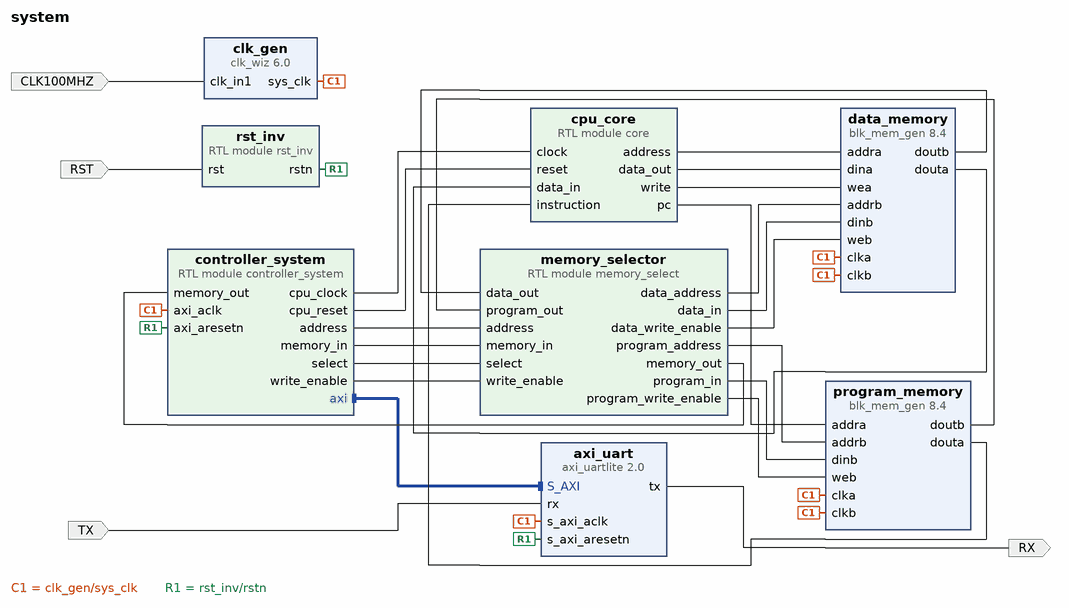
[diagram p0: block diagram of the top level]
# Vivado block design system, xc7a100tcsg324-1, Vivado 2023.1.1
create_bd_design system

create_bd_port -dir I -type data TX
create_bd_port -dir O -type data RX
create_bd_port -dir I -type clk CLK100MHZ
set_property -dict {CONFIG.FREQ_HZ 100000000} [get_bd_ports CLK100MHZ]
create_bd_port -dir I -type rst RST
set_property -dict {CONFIG.POLARITY ACTIVE_HIGH} [get_bd_ports RST]

create_bd_cell -type ip -vlnv xilinx.com:ip:axi_uartlite:2.0 axi_uart
set_property -dict {CONFIG.C_BAUDRATE 115200 CONFIG.UARTLITE_BOARD_INTERFACE Custom} [get_bd_cells axi_uart]
create_bd_cell -type module -reference rst_inv rst_inv
create_bd_cell -type ip -vlnv xilinx.com:ip:blk_mem_gen:8.4 data_memory
set_property -dict [list \
  CONFIG.Additional_Inputs_for_Power_Estimation false \
  CONFIG.Algorithm Minimum_Area \
  CONFIG.Assume_Synchronous_Clk true \
  CONFIG.Enable_A Always_Enabled \
  CONFIG.Enable_B Always_Enabled \
  CONFIG.Fill_Remaining_Memory_Locations true \
  CONFIG.Load_Init_File false \
  CONFIG.Memory_Type True_Dual_Port_RAM \
  CONFIG.Operating_Mode_A NO_CHANGE \
  CONFIG.Operating_Mode_B NO_CHANGE \
  CONFIG.Read_Width_B 32 \
  CONFIG.Register_PortA_Output_of_Memory_Core false \
  CONFIG.Register_PortA_Output_of_Memory_Primitives false \
  CONFIG.Register_PortB_Output_of_Memory_Primitives false \
  CONFIG.Remaining_Memory_Locations DEADBEEF \
  CONFIG.Use_RSTA_Pin false \
  CONFIG.Write_Depth_A 1024 \
  CONFIG.Write_Width_B 8 \
  CONFIG.use_bram_block Stand_Alone \
] [get_bd_cells data_memory]
create_bd_cell -type ip -vlnv xilinx.com:ip:blk_mem_gen:8.4 program_memory
set_property -dict [list \
  CONFIG.Assume_Synchronous_Clk true \
  CONFIG.Enable_A Always_Enabled \
  CONFIG.Enable_B Always_Enabled \
  CONFIG.Fill_Remaining_Memory_Locations true \
  CONFIG.Memory_Type True_Dual_Port_RAM \
  CONFIG.Operating_Mode_A READ_FIRST \
  CONFIG.Operating_Mode_B WRITE_FIRST \
  CONFIG.Read_Width_B 16 \
  CONFIG.Register_PortA_Output_of_Memory_Primitives false \
  CONFIG.Register_PortB_Output_of_Memory_Primitives false \
  CONFIG.Remaining_Memory_Locations FFFF \
  CONFIG.Write_Depth_A 1024 \
  CONFIG.Write_Width_A 16 \
  CONFIG.Write_Width_B 8 \
  CONFIG.use_bram_block Stand_Alone \
] [get_bd_cells program_memory]
create_bd_cell -type ip -vlnv xilinx.com:ip:clk_wiz:6.0 clk_gen
set_property -dict [list \
  CONFIG.CLKOUT1_DRIVES BUFGCE \
  CONFIG.CLKOUT1_JITTER 116.394 \
  CONFIG.CLKOUT1_PHASE_ERROR 87.466 \
  CONFIG.CLKOUT1_USED true \
  CONFIG.CLKOUT2_DRIVES BUFGCE \
  CONFIG.CLKOUT3_DRIVES BUFGCE \
  CONFIG.CLKOUT4_DRIVES BUFGCE \
  CONFIG.CLKOUT5_DRIVES BUFGCE \
  CONFIG.CLKOUT6_DRIVES BUFGCE \
  CONFIG.CLKOUT7_DRIVES BUFGCE \
  CONFIG.CLK_OUT1_PORT sys_clk \
  CONFIG.FEEDBACK_SOURCE FDBK_AUTO \
  CONFIG.JITTER_SEL Min_O_Jitter \
  CONFIG.MMCM_BANDWIDTH HIGH \
  CONFIG.MMCM_CLKFBOUT_MULT_F 11.875 \
  CONFIG.MMCM_CLKOUT0_DIVIDE_F 11.875 \
  CONFIG.USE_LOCKED false \
  CONFIG.USE_RESET false \
  CONFIG.USE_SAFE_CLOCK_STARTUP true \
] [get_bd_cells clk_gen]
create_bd_cell -type module -reference memory_select memory_selector
create_bd_cell -type module -reference core cpu_core
create_bd_cell -type module -reference controller_system controller_system

# ---- connections ----

connect_bd_intf_net [get_bd_intf_pins controller_system/axi] [get_bd_intf_pins axi_uart/S_AXI]
connect_bd_net [get_bd_ports CLK100MHZ] [get_bd_pins clk_gen/clk_in1]
connect_bd_net [get_bd_ports RST] [get_bd_pins rst_inv/rst]
connect_bd_net [get_bd_ports TX] [get_bd_pins axi_uart/rx]
connect_bd_net [get_bd_pins axi_uart/tx] [get_bd_ports RX]
connect_bd_net [get_bd_pins clk_gen/sys_clk] \
  [get_bd_pins axi_uart/s_axi_aclk] [get_bd_pins program_memory/clka] [get_bd_pins program_memory/clkb] \
  [get_bd_pins data_memory/clka] [get_bd_pins data_memory/clkb] [get_bd_pins controller_system/axi_aclk]
connect_bd_net [get_bd_pins controller_system/address] [get_bd_pins memory_selector/address]
connect_bd_net [get_bd_pins controller_system/cpu_clock] [get_bd_pins cpu_core/clock]
connect_bd_net [get_bd_pins controller_system/cpu_reset] [get_bd_pins cpu_core/reset]
connect_bd_net [get_bd_pins controller_system/memory_in] [get_bd_pins memory_selector/memory_in]
connect_bd_net [get_bd_pins controller_system/select] [get_bd_pins memory_selector/select]
connect_bd_net [get_bd_pins controller_system/write_enable] [get_bd_pins memory_selector/write_enable]
connect_bd_net [get_bd_pins cpu_core/address] [get_bd_pins data_memory/addra]
connect_bd_net [get_bd_pins cpu_core/data_out] [get_bd_pins data_memory/dina]
connect_bd_net [get_bd_pins cpu_core/pc] [get_bd_pins program_memory/addra]
connect_bd_net [get_bd_pins cpu_core/write] [get_bd_pins data_memory/wea]
connect_bd_net [get_bd_pins data_memory/douta] [get_bd_pins cpu_core/data_in]
connect_bd_net [get_bd_pins data_memory/doutb] [get_bd_pins memory_selector/data_out]
connect_bd_net [get_bd_pins memory_selector/data_address] [get_bd_pins data_memory/addrb]
connect_bd_net [get_bd_pins memory_selector/data_in] [get_bd_pins data_memory/dinb]
connect_bd_net [get_bd_pins memory_selector/data_write_enable] [get_bd_pins data_memory/web]
connect_bd_net [get_bd_pins memory_selector/memory_out] [get_bd_pins controller_system/memory_out]
connect_bd_net [get_bd_pins memory_selector/program_address] [get_bd_pins program_memory/addrb]
connect_bd_net [get_bd_pins memory_selector/program_in] [get_bd_pins program_memory/dinb]
connect_bd_net [get_bd_pins memory_selector/program_write_enable] [get_bd_pins program_memory/web]
connect_bd_net [get_bd_pins program_memory/douta] [get_bd_pins cpu_core/instruction]
connect_bd_net [get_bd_pins program_memory/doutb] [get_bd_pins memory_selector/program_out]
connect_bd_net [get_bd_pins rst_inv/rstn] [get_bd_pins axi_uart/s_axi_aresetn] [get_bd_pins controller_system/axi_aresetn]

# ---- address map ----
exclude_bd_addr_seg -offset 0x40600000 -range 64K -target_address_space [get_bd_addr_spaces controller_system/axi] [get_bd_addr_segs axi_uart/S_AXI/Reg]

validate_bd_design
save_bd_design
